# Altium project Navigator_Kill_Board.PrjPcb
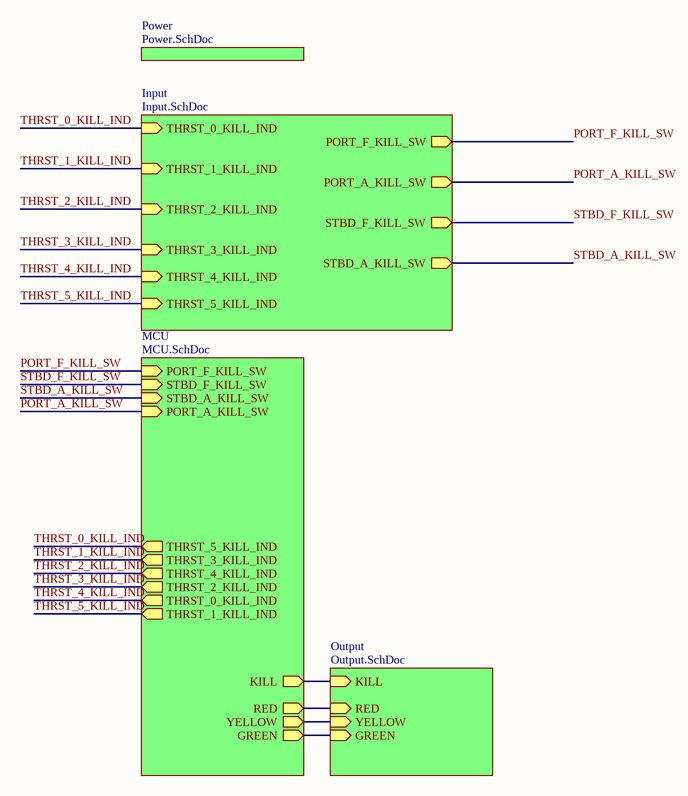
[diagram p0: Top_Level.SchDoc]
5 sheets, 108 parts. Net scope: hierarchical (ports join the sheet entries above them; power ports are global).
Board file: KillBoard.PcbDoc
Sheets:
  Top_Level.SchDoc
    Output = Output.SchDoc
    Input = Input.SchDoc
    Power = Power.SchDoc
    MCU = MCU.SchDoc

## Sheet Top_Level.SchDoc
size A; SheetNumber: 1; SheetTotal: 5

### Sub-sheets
Input = Input.SchDoc: PORT_F_KILL_SW (out), PORT_A_KILL_SW (out), STBD_F_KILL_SW (out), STBD_A_KILL_SW (out), THRST_0_KILL_IND (in), THRST_5_KILL_IND (in), THRST_4_KILL_IND (in), THRST_2_KILL_IND (in), THRST_3_KILL_IND (in), THRST_1_KILL_IND (in)
MCU = MCU.SchDoc: KILL (out), RED (out), GREEN (out), YELLOW (out), THRST_5_KILL_IND (out), THRST_3_KILL_IND (out), THRST_4_KILL_IND (out), THRST_2_KILL_IND (out), THRST_0_KILL_IND (out), THRST_1_KILL_IND (out), PORT_F_KILL_SW (in), STBD_F_KILL_SW (in), STBD_A_KILL_SW (in), PORT_A_KILL_SW (in)
Output = Output.SchDoc: KILL (in), RED (in), YELLOW (in), GREEN (in)
Power = Power.SchDoc: no entries

### Nets
GREEN: sheet Output/GREEN, sheet MCU/GREEN
KILL: sheet Output/KILL, sheet MCU/KILL
PORT_A_KILL_SW: sheet Input/PORT_A_KILL_SW, sheet MCU/PORT_A_KILL_SW
PORT_F_KILL_SW: sheet Input/PORT_F_KILL_SW, sheet MCU/PORT_F_KILL_SW
RED: sheet Output/RED, sheet MCU/RED
STBD_A_KILL_SW: sheet Input/STBD_A_KILL_SW, sheet MCU/STBD_A_KILL_SW
STBD_F_KILL_SW: sheet Input/STBD_F_KILL_SW, sheet MCU/STBD_F_KILL_SW
THRST_0_KILL_IND: sheet Input/THRST_0_KILL_IND, sheet MCU/THRST_5_KILL_IND
THRST_1_KILL_IND: sheet Input/THRST_1_KILL_IND, sheet MCU/THRST_3_KILL_IND
THRST_2_KILL_IND: sheet Input/THRST_2_KILL_IND, sheet MCU/THRST_4_KILL_IND
THRST_3_KILL_IND: sheet Input/THRST_3_KILL_IND, sheet MCU/THRST_2_KILL_IND
THRST_4_KILL_IND: sheet Input/THRST_4_KILL_IND, sheet MCU/THRST_0_KILL_IND
THRST_5_KILL_IND: sheet Input/THRST_5_KILL_IND, sheet MCU/THRST_1_KILL_IND
YELLOW: sheet Output/YELLOW, sheet MCU/YELLOW

## Sheet Output.SchDoc
size A; SheetNumber: 5; SheetTotal: 6
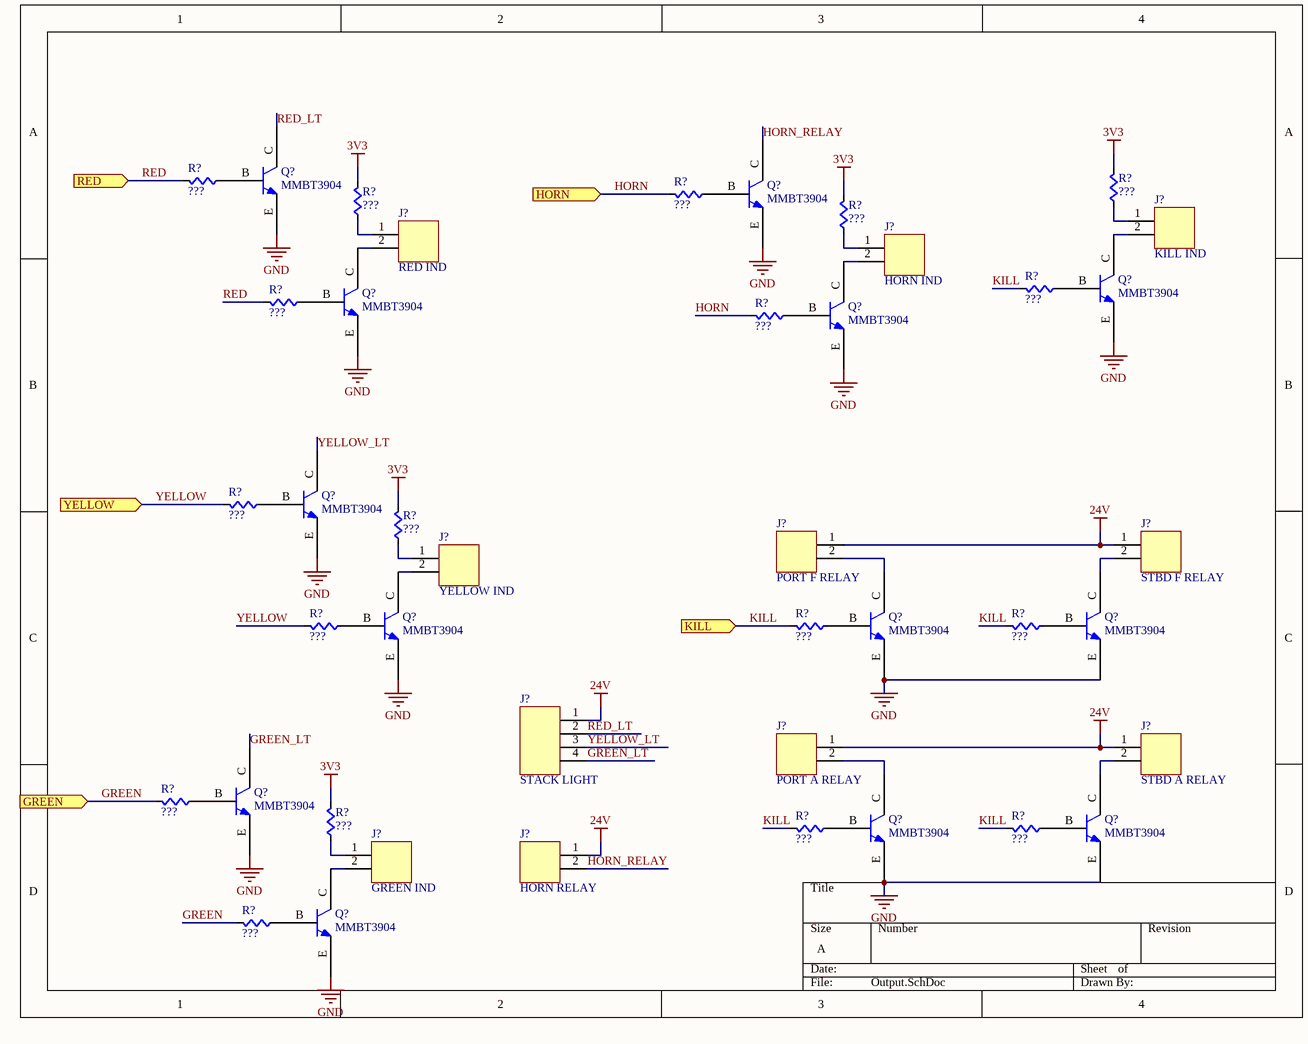
[diagram p1: Output.SchDoc]

### Parts
(Parts that share a designator on the sheet are numbered #1, #2 ... from top to bottom, then left to right.)
J15  RED IND  [MOLEX-HDR-1X2-SHERLOCK-VERT]
J16  KILL IND  [MOLEX-HDR-1X2-SHERLOCK-VERT]
J19  PORT F RELAY  [MOLEX-HDR-1X2-SHERLOCK-VERT]
J20  STBD F RELAY  [MOLEX-HDR-1X2-SHERLOCK-VERT]
J21  YELLOW IND  [MOLEX-HDR-1X2-SHERLOCK-VERT]
J22  STACK LIGHT  [MOLEX-HDR-1X4-SHERLOCK-VERT]
J23  PORT A RELAY  [MOLEX-HDR-1X2-SHERLOCK-VERT]
J24  STBD A RELAY  [MOLEX-HDR-1X2-SHERLOCK-VERT]
J25  GREEN IND  [MOLEX-HDR-1X2-SHERLOCK-VERT]
J?#1  HORN IND  [MOLEX-HDR-1X2-SHERLOCK-VERT]
J?#2  HORN RELAY  [MOLEX-HDR-1X2-SHERLOCK-VERT]
Q7  MMBT3904  [MMBT3904]
Q8  MMBT3904  [MMBT3904]
Q9  MMBT3904  [MMBT3904]
Q12  MMBT3904  [MMBT3904]
Q13  MMBT3904  [MMBT3904]
Q14  MMBT3904  [MMBT3904]
Q15  MMBT3904  [MMBT3904]
Q16  MMBT3904  [MMBT3904]
Q17  MMBT3904  [MMBT3904]
Q18  MMBT3904  [MMBT3904]
Q19  MMBT3904  [MMBT3904]
Q?#1  MMBT3904  [MMBT3904]
Q?#2  MMBT3904  [MMBT3904]
R22  value ???  [RES0603]  (hidden comment: Res)
R23  value ???  [RES0603]  (hidden comment: Res)
R24  value ???  [RES0603]  (hidden comment: Res)
R25  value ???  [RES0603]  (hidden comment: Res)
R26  value ???  [RES0603]  (hidden comment: Res)
R31  value ???  [RES0603]  (hidden comment: Res)
R32  value ???  [RES0603]  (hidden comment: Res)
R35  value ???  [RES0603]  (hidden comment: Res)
R36  value ???  [RES0603]  (hidden comment: Res)
R37  value ???  [RES0603]  (hidden comment: Res)
R38  value ???  [RES0603]  (hidden comment: Res)
R41  value ???  [RES0603]  (hidden comment: Res)
R42  value ???  [RES0603]  (hidden comment: Res)
R43  value ???  [RES0603]  (hidden comment: Res)
R44  value ???  [RES0603]  (hidden comment: Res)
R?#1  value ???  [RES0603]  (hidden comment: Res)
R?#2  value ???  [RES0603]  (hidden comment: Res)
R?#3  value ???  [RES0603]  (hidden comment: Res)

### Ports
GREEN (in), HORN (in), KILL (in), RED (in), YELLOW (in)

### Nets
3V3: R23.1(A) R24.1(A) R32.1(A) R41.1(A) R?#2.1(A)
24V: J19.1 J20.1 J22.1 J23.1 J24.1 J?#2.1
GND: Q7.E Q8.E Q9.E Q12.E Q13.E Q14.E Q15.E Q16.E Q17.E Q18.E Q19.E Q?#1.E Q?#2.E
GREEN: R38.1(A) R44.1(A) ; port GREEN
GREEN_LT: J22.4 Q16.C
HORN: R?#1.1(A) R?#3.1(A) ; port HORN
HORN_RELAY: J?#2.2 Q?#1.C
KILL: R26.1(A) R36.1(A) R37.1(A) R42.1(A) R43.1(A) ; port KILL
RED: R22.1(A) R25.1(A) ; port RED
RED_LT: J22.2 Q7.C
YELLOW: R31.1(A) R35.1(A) ; port YELLOW
YELLOW_LT: J22.3 Q12.C
NetJ15_1: J15.1 R23.2(B)
NetJ15_2: J15.2 Q8.C
NetJ16_1: J16.1 R24.2(B)
NetJ16_2: J16.2 Q9.C
NetJ19_2: J19.2 Q14.C
NetJ20_2: J20.2 Q15.C
NetJ21_1: J21.1 R32.2(B)
NetJ21_2: J21.2 Q13.C
NetJ23_2: J23.2 Q17.C
NetJ24_2: J24.2 Q18.C
NetJ25_1: J25.1 R41.2(B)
NetJ25_2: J25.2 Q19.C
NetJ?#1_1: J?#1.1 R?#2.2(B)
NetJ?#1_2: J?#1.2 Q?#2.C
NetQ7_B: Q7.B R22.2(B)
NetQ8_B: Q8.B R25.2(B)
NetQ9_B: Q9.B R26.2(B)
NetQ12_B: Q12.B R31.2(B)
NetQ13_B: Q13.B R35.2(B)
NetQ14_B: Q14.B R36.2(B)
NetQ15_B: Q15.B R37.2(B)
NetQ16_B: Q16.B R38.2(B)
NetQ17_B: Q17.B R42.2(B)
NetQ18_B: Q18.B R43.2(B)
NetQ19_B: Q19.B R44.2(B)
NetQ?#1_B: Q?#1.B R?#1.2(B)
NetQ?#2_B: Q?#2.B R?#3.2(B)

### Library data of the parts
J15 J16 J19-J21 J23-J25 J?#1 J?#2 = MOLEX-HDR-1x2-SHERLOCK_VERT: Header, Molex, 2mm Pitch Sherlock Header, Single Row, Vertical, 2 Circuits, Length 3.3mm, 0353620250; Manufacturer Part Number: *; Order Part Number: *
J22 = MOLEX-HDR-1x4-SHERLOCK_VERT: Header, Molex, 2mm Pitch Sherlock Header, Single Row, Vertical, 4 Circuits, Length 3.3mm, 0353620450; Manufacturer Part Number: *; Order Part Number: *
Q7-Q9 Q12-Q19 Q?#1 Q?#2 = MMBT3904: TRANS NPN 40V 0.2A SOT-23; Manufacturer 1: Fairchild Semiconductor; Supplier 1: Digi-Key; Supplier Part Number 1: MMBT3904FSCT-ND; Manufacturer Part Number 1: MMBT3904
R?#1-R?#18 = Res: Supplier 1: Digi-Key; Supplier Part Number 1: RMCF0603JT10K0CT-ND

## Sheet Input.SchDoc
size A; SheetNumber: 2; SheetTotal: 5
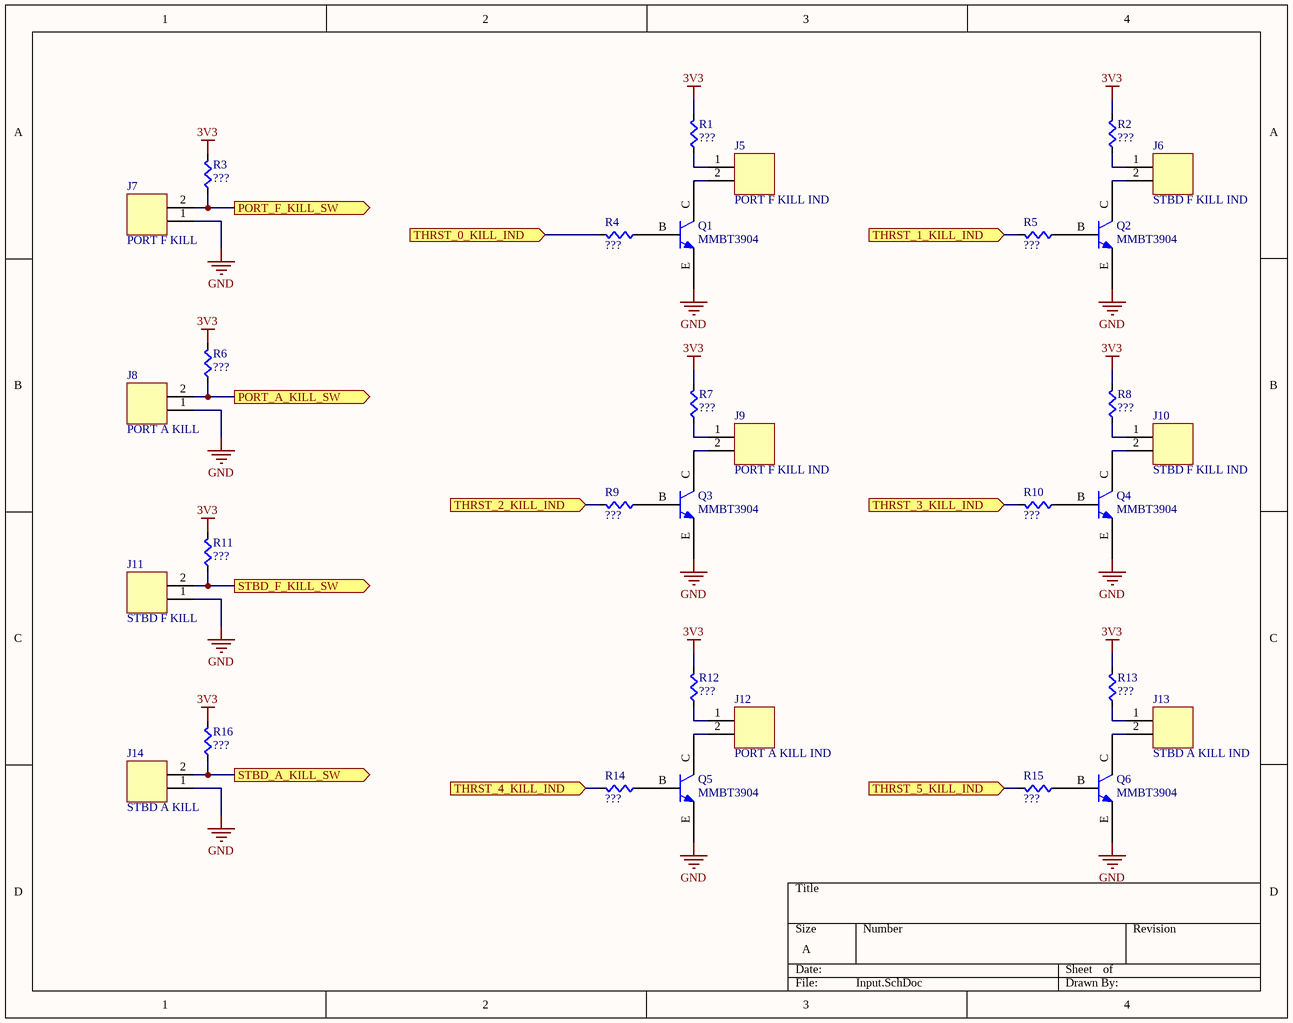
[diagram p2: Input.SchDoc]

### Parts
J5  PORT F KILL IND  [MOLEX-HDR-1X2-SHERLOCK-VERT]
J6  STBD F KILL IND  [MOLEX-HDR-1X2-SHERLOCK-VERT]
J7  PORT F KILL  [MOLEX-HDR-1X2-SHERLOCK-VERT]
J8  PORT A KILL  [MOLEX-HDR-1X2-SHERLOCK-VERT]
J9  PORT F KILL IND  [MOLEX-HDR-1X2-SHERLOCK-VERT]
J10  STBD F KILL IND  [MOLEX-HDR-1X2-SHERLOCK-VERT]
J11  STBD F KILL  [MOLEX-HDR-1X2-SHERLOCK-VERT]
J12  PORT A KILL IND  [MOLEX-HDR-1X2-SHERLOCK-VERT]
J13  STBD A KILL IND  [MOLEX-HDR-1X2-SHERLOCK-VERT]
J14  STBD A KILL  [MOLEX-HDR-1X2-SHERLOCK-VERT]
Q1  MMBT3904  [MMBT3904]
Q2  MMBT3904  [MMBT3904]
Q3  MMBT3904  [MMBT3904]
Q4  MMBT3904  [MMBT3904]
Q5  MMBT3904  [MMBT3904]
Q6  MMBT3904  [MMBT3904]
R1  value ???  [RES0603]  (hidden comment: Res)
R2  value ???  [RES0603]  (hidden comment: Res)
R3  value ???  [RES0603]  (hidden comment: Res)
R4  value ???  [RES0603]  (hidden comment: Res)
R5  value ???  [RES0603]  (hidden comment: Res)
R6  value ???  [RES0603]  (hidden comment: Res)
R7  value ???  [RES0603]  (hidden comment: Res)
R8  value ???  [RES0603]  (hidden comment: Res)
R9  value ???  [RES0603]  (hidden comment: Res)
R10  value ???  [RES0603]  (hidden comment: Res)
R11  value ???  [RES0603]  (hidden comment: Res)
R12  value ???  [RES0603]  (hidden comment: Res)
R13  value ???  [RES0603]  (hidden comment: Res)
R14  value ???  [RES0603]  (hidden comment: Res)
R15  value ???  [RES0603]  (hidden comment: Res)
R16  value ???  [RES0603]  (hidden comment: Res)

### Ports
PORT_A_KILL_SW (out), PORT_F_KILL_SW (out), STBD_A_KILL_SW (out), STBD_F_KILL_SW (out), THRST_0_KILL_IND (in), THRST_1_KILL_IND (in), THRST_2_KILL_IND (in), THRST_3_KILL_IND (in), THRST_4_KILL_IND (in), THRST_5_KILL_IND (in)

### Nets
3V3: R1.1(A) R2.1(A) R3.1(A) R6.1(A) R7.1(A) R8.1(A) R11.1(A) R12.1(A) R13.1(A) R16.1(A)
GND: J7.1 J8.1 J11.1 J14.1 Q1.E Q2.E Q3.E Q4.E Q5.E Q6.E
PORT_A_KILL_SW: J8.2 R6.2(B) ; port PORT_A_KILL_SW
PORT_F_KILL_SW: J7.2 R3.2(B) ; port PORT_F_KILL_SW
STBD_A_KILL_SW: J14.2 R16.2(B) ; port STBD_A_KILL_SW
STBD_F_KILL_SW: J11.2 R11.2(B) ; port STBD_F_KILL_SW
THRST_0_KILL_IND: R4.1(A) ; port THRST_0_KILL_IND
THRST_1_KILL_IND: R5.1(A) ; port THRST_1_KILL_IND
THRST_2_KILL_IND: R9.1(A) ; port THRST_2_KILL_IND
THRST_3_KILL_IND: R10.1(A) ; port THRST_3_KILL_IND
THRST_4_KILL_IND: R14.1(A) ; port THRST_4_KILL_IND
THRST_5_KILL_IND: R15.1(A) ; port THRST_5_KILL_IND
NetJ5_1: J5.1 R1.2(B)
NetJ5_2: J5.2 Q1.C
NetJ6_1: J6.1 R2.2(B)
NetJ6_2: J6.2 Q2.C
NetJ9_1: J9.1 R7.2(B)
NetJ9_2: J9.2 Q3.C
NetJ10_1: J10.1 R8.2(B)
NetJ10_2: J10.2 Q4.C
NetJ12_1: J12.1 R12.2(B)
NetJ12_2: J12.2 Q5.C
NetJ13_1: J13.1 R13.2(B)
NetJ13_2: J13.2 Q6.C
NetQ1_B: Q1.B R4.2(B)
NetQ2_B: Q2.B R5.2(B)
NetQ3_B: Q3.B R9.2(B)
NetQ4_B: Q4.B R10.2(B)
NetQ5_B: Q5.B R14.2(B)
NetQ6_B: Q6.B R15.2(B)

### Library data of the parts
J5-J14 = MOLEX-HDR-1x2-SHERLOCK_VERT: as J15 on sheet Output; Manufacturer Part Number: *; Order Part Number: *
Q1-Q6 = MMBT3904: as Q7 on sheet Output; Supplier 1: Digi-Key; Supplier Part Number 1: MMBT3904FSCT-ND; Manufacturer Part Number 1: MMBT3904
R1-R16 = Res: Supplier 1: Digi-Key; Supplier Part Number 1: RMCF0603JT10K0CT-ND

## Sheet Power.SchDoc
size A; SheetNumber: 6; SheetTotal: 6
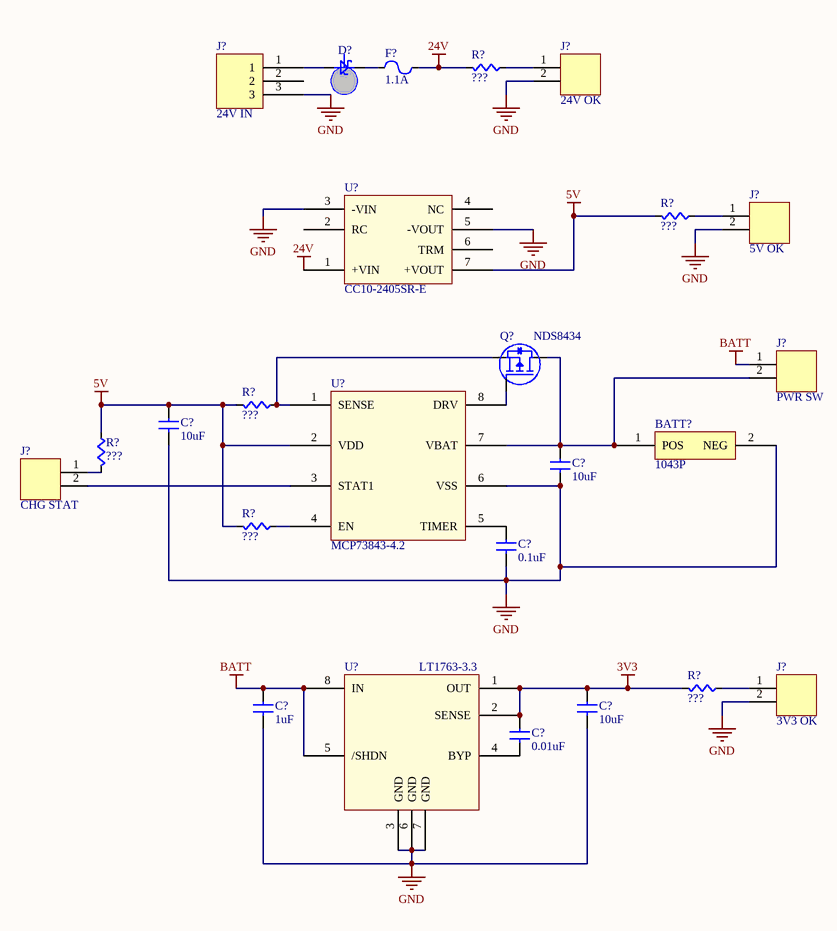
[diagram p3: Power.SchDoc]

### Parts
(Parts that share a designator on the sheet are numbered #1, #2 ... from top to bottom, then left to right.)
BATT?  1043P  [1043P]
C?#1  value 10uF  [CAPC0805]  (hidden comment: Cap)
C?#2  value 10uF  [CAPC0805]  (hidden comment: Cap)
C?#3  value 0.1uF  [CAPC0603]  (hidden comment: Cap)
C?#4  value 1uF  [CAPC0603]  (hidden comment: Cap)
C?#5  value 10uF  [CAPC0805]  (hidden comment: Cap)
C?#6  value 0.01uF  [CAPC0603]  (hidden comment: Cap)
D1  VS-15MQ040NTRPBF  [SS110-TP]  (value not drawn)
F1  value 1.1A  [PTC7451X11N]  (hidden comment: PTC Fuse)
J1  24V IN  [MCV_0,5/3-G-2,5]
J2  24V OK  [MOLEX-HDR-1X2-SHERLOCK-VERT]
J3  5V OK  [MOLEX-HDR-1X2-SHERLOCK-VERT]
J4  3V3 OK  [MOLEX-HDR-1X2-SHERLOCK-VERT]
J?#3  PWR SW  [MOLEX-HDR-1X2-SHERLOCK-VERT]
J?#4  CHG STAT  [MOLEX-HDR-1X2-SHERLOCK-VERT]
Q?#3  NDS8434  [NDS8434]
R?#4  value ???  [RES0603]  (hidden comment: Res)
R?#5  value ???  [RES0603]  (hidden comment: Res)
R?#6  value ???  [RES0603]  (hidden comment: Res)
R?#7  value ???  [RES0603]  (hidden comment: Res)
R?#8  value ???  [RES0603]  (hidden comment: Res)
R?#9  value ???  [RES0603]  (hidden comment: Res)
U?#1  CC10-2405SR-E  [CC10-2405SR-E]
U?#2  MCP73843-4.2  [MSOP-8N]
U?#3  LT1763-3.3  [8-SOIC]

### Nets
3V3: C?#5.1(A) C?#6.1(A) R?#9.1(A) U?#3.1(OUT) U?#3.2(SENSE)
5V: C?#1.1(A) R?#5.1(A) R?#6.1(A) R?#7.2(B) R?#8.1(A) U?#1.7(+VOUT) U?#2.2(VDD)
24V: F1.1(A) R?#4.1(A) U?#1.1(+VIN)
BATT: C?#4.1(A) J?#3.1 U?#3.5(/SHDN) U?#3.8(IN)
GND: BATT?.2(NEG) C?#1.2(B) C?#2.2(B) C?#3.2(B) C?#4.2(B) C?#5.2(B) J1.3 J2.2 J3.2 J4.2 U?#1.3(-VIN) U?#1.5(-VOUT) U?#2.6(VSS) U?#3.3(GND) U?#3.6(GND) U?#3.7(GND)
NetBATT?_1: BATT?.1(POS) C?#2.1(A) J?#3.2 Q?#3.D U?#2.7(VBAT)
NetC?#3_1: C?#3.1(A) U?#2.5(TIMER)
NetC?#6_2: C?#6.2(B) U?#3.4(BYP)
NetD1_A: D1.A J1.1
NetD1_C: D1.C F1.2(B)
NetJ2_1: J2.1 R?#4.2(B)
NetJ3_1: J3.1 R?#5.2(B)
NetJ4_1: J4.1 R?#9.2(B)
NetJ?#4_1: J?#4.1 R?#7.1(A)
NetJ?#4_2: J?#4.2 U?#2.3(STAT1)
NetQ?#3_G: Q?#3.G U?#2.8(DRV)
NetQ?#3_S: Q?#3.S R?#6.2(B) U?#2.1(SENSE)
NetR?#8_2: R?#8.2(B) U?#2.4(EN)

Not connected (* = marked no-connect by the designer): J1 2; U?#1 2(RC) 4(NC) 6(TRM)

### Library data of the parts
BATT? = 1043P: HOLDER FOR 18650 BATTERY; Manufacturer 1: Keystone Electronics; Supplier 1: Digi-Key; Supplier Part Number 1: 36-1043P-ND; Manufacturer Part Number 1: 1043P
D1 = VS-15MQ040NTRPBF: DIODE SCHOTTKY 40V 1.5A SMA; Manufacturer 1: Vishay Semiconductor Diodes Division; Supplier 1: Digi-Key; Supplier Part Number 1: 15MQ040NPBFCT-ND; Manufacturer Part Number 1: VS-15MQ040NTRPBF
F1 = PTC_Fuse: Supplier 1: Digi-Key; Supplier Part Number 1: 507-1744-1-ND
J1 = MCV_0,5/3-G-2,5: CONN TERM BLOCK 2.50MM 3POS, Vertical, Through-Hole, 4A; Manufacturer 1: Phoenix Contact; Manufacturer Part Number 1: 1881561; Mating Connector: 277-1431-ND; Manufacturer Part Number: *; Order Part Number: *
J2-J4 J?#3 J?#4 = MOLEX-HDR-1x2-SHERLOCK_VERT: as J15 on sheet Output; Supplier 1: Digi-Key; Supplier Part Number 1: 277-1453-ND
Q?#3 = NDS8434: MOSFET P-CH 20V 6.5A 8-SOIC; Manufacturer 1: Fairchild Semiconductor; Manufacturer Part Number 1: NDS8434; Supplier 1: Digi-Key; Supplier Part Number 1: NDS8434CT-ND
U?#1 = CC10-2405SR-E: CONV DC/DC 10W SNGL 24V 5V SMD; Manufacturer: TDK-Lambda Americas Inc.; Manufacturer Part Number 1: CC10-2405SR-E; Supplier Part Number 1: 445-3307-ND; Supplier 1: Digi-Key
U?#2 = MCP73843-4.2: IC CONTROLLER LI-ION 4.2V 8MSOP; Manufacturer 1: Microchip Technology; Manufacturer Part Number 1: MCP73843-420I/MS; Supplier 1: Digi-Key; Supplier Part Number 1: MCP73843-420I/MS-ND
U?#3 = LT1763-3.3: IC REG LDO 3.3V 0.5A 8SOIC; Manufacturer 1: Linear Technology; Manufacturer Part Number 1: LT1763CS8-3.3#TRPBF; Supplier 1: Digi-Key; Supplier Part Number 1: LT1763CS8-3.3#TRPBFCT-ND
C?#1-C?#6 = Cap: Supplier 1: Digi-Key
  C?#1 C?#2 C?#5: Supplier Part Number 1: 490-3905-1-ND
  C?#3 C?#6: Supplier Part Number 1: 1276-1000-1-ND
  C?#4: Supplier Part Number 1: 490-3897-1-ND
R?#19-R?#24 = Res: Supplier 1: Digi-Key; Supplier Part Number 1: RMCF0603JT10K0CT-ND

## Sheet MCU.SchDoc
size B; SheetNumber: 2; SheetTotal: 6
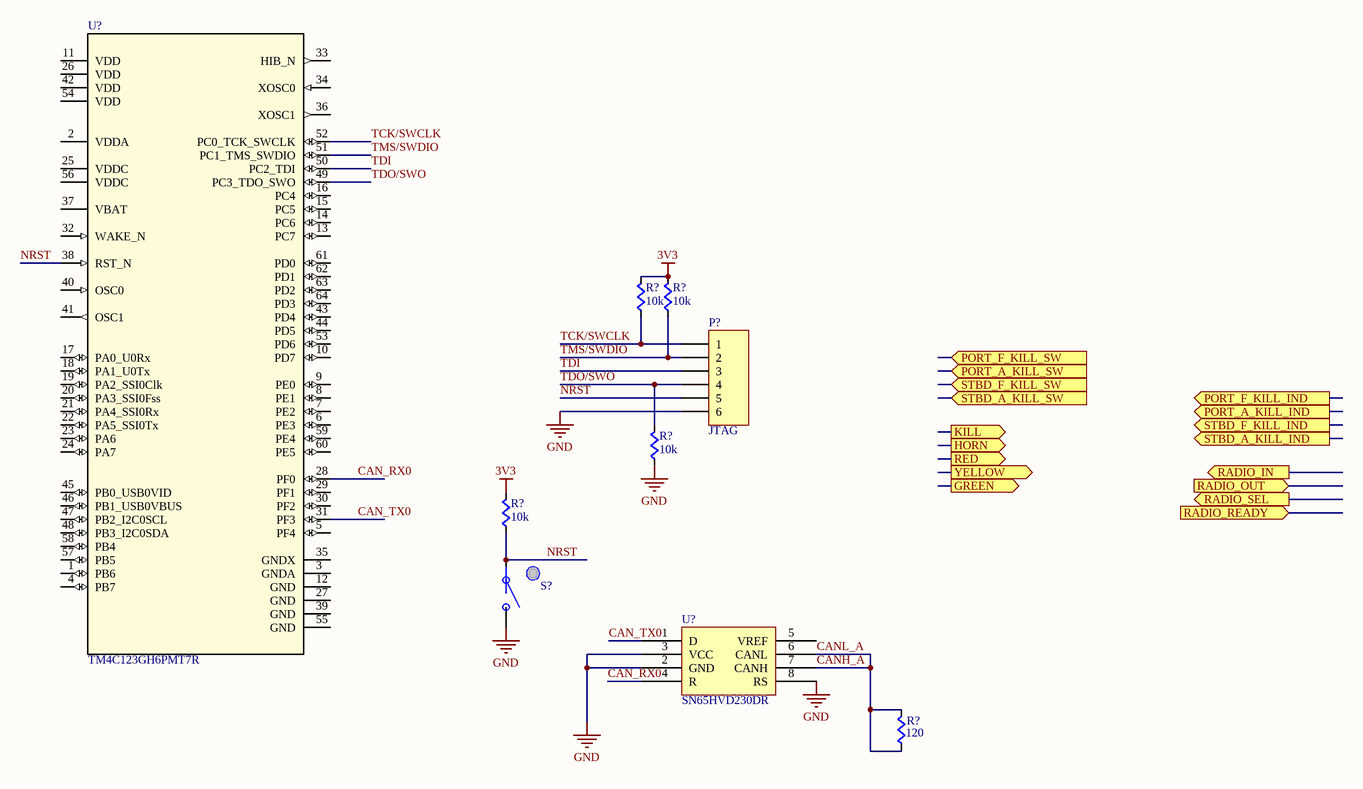
[diagram p4: MCU.SchDoc]

### Parts
(Parts that share a designator on the sheet are numbered #1, #2 ... from top to bottom, then left to right.)
P1  JTAG  [HDR1X6]
R17  value 10k  [RES0603]  (hidden comment: Res)
R18  value 10k  [RES0603]  (hidden comment: Res)
R19  value 10k  [RES0603]  (hidden comment: Res)
R20  value 10k  [RES0603]  (hidden comment: Res)
R?#10  value 120  [RES0603]  (hidden comment: Res)
S1  Button  [PTS645xxxxSMTR92]  (value not drawn)
U1  SN65HVD230DR  [SOIC-8pin]
U?#4  TM4C123GH6PMT7R  [PM0064A_N]

### Ports
GREEN (out), HORN (out), KILL (out), PORT_A_KILL_IND (out), PORT_A_KILL_SW (in), PORT_F_KILL_IND (out), PORT_F_KILL_SW (in), RADIO_IN (out), RADIO_OUT (in), RADIO_READY (in), RADIO_SEL (out), RED (out), STBD_A_KILL_IND (out), STBD_A_KILL_SW (in), STBD_F_KILL_IND (out), STBD_F_KILL_SW (in), YELLOW (out)

### Nets
3V3: R17.1(A) R18.1(A) R19.1(A)
GND: P1.6 R20.2(B) S1.B U1.2(GND) U1.3(VCC) U1.8(RS)
CAN_RX0: U1.4(R) U?#4.28(PF0)
CAN_TX0: U1.1(D) U?#4.31(PF3)
CANH_A: R?#10.1(A) R?#10.2(B) U1.6(CANL) U1.7(CANH)  [also labelled CANL_A]
NRST: P1.5 R19.2(B) S1.A U?#4.38(RST_N)
TCK/SWCLK: P1.1 R17.2(B) U?#4.52(PC0_TCK_SWCLK)
TDI: P1.3 U?#4.50(PC2_TDI)
TDO/SWO: P1.4 R20.1(A) U?#4.49(PC3_TDO_SWO)
TMS/SWDIO: P1.2 R18.2(B) U?#4.51(PC1_TMS_SWDIO)

Not connected (* = marked no-connect by the designer): U1 5(VREF); U?#4 1(PB6) 2(VDDA) 3(GNDA) 4(PB7) 5(PF4) 6(PE3) 7(PE2) 8(PE1) 9(PE0) 10(PD7) 11(VDD) 12(GND) 13(PC7) 14(PC6) 15(PC5) 16(PC4) 17(PA0_U0Rx) 18(PA1_U0Tx) 19(PA2_SSI0Clk) 20(PA3_SSI0Fss) 21(PA4_SSI0Rx) 22(PA5_SSI0Tx) 23(PA6) 24(PA7) 25(VDDC) 26(VDD) 27(GND) 29(PF1) 30(PF2) 32(WAKE_N) 33(HIB_N) 34(XOSC0) 35(GNDX) 36(XOSC1) 37(VBAT) 39(GND) 40(OSC0) 41(OSC1) 42(VDD) 43(PD4) 44(PD5) 45(PB0_USB0VID) 46(PB1_USB0VBUS) 47(PB2_I2C0SCL) 48(PB3_I2C0SDA) 53(PD6) 54(VDD) 55(GND) 56(VDDC) 57(PB5) 58(PB4) 59(PE4) 60(PE5) 61(PD0) 62(PD1) 63(PD2) 64(PD3)

### Library data of the parts
P1 = Header 6: Header, 6-Pin
S1 = Button: SPST Button
U1 = SN65HVD230DR: IC TXRX CAN 1MBPS 3.3V 8SOIC
U?#4 = TM4C123GH6PMT7R: Imported; PartNumber: TM4C123GH6PMTR; Manufacturer: Texas Instruments; CompType: IC; PIN_COUNT: 64; Application_BuildNumber: *; Alternate_PartNumber: TM4C123GH6PMT; PackageReference: PM0064A; MountType: SMT; RoHS: Y; RefDes: RefDes; TYPE: TYPE; Value: Value

## Nets that join several sheets
3V3: Output (5 pins), Input (10 pins), Power (5 pins), MCU (R17.1 R18.1 R19.1)
24V: Output (6 pins), Power (F1.1 R?#4.1 U?#1.1)
GND: Output (13 pins), Input (10 pins), Power (16 pins), MCU (6 pins)